# Altium schematic sheet DSO_Control.SchDoc: Schematic_Name
size A4; CompanyName: University of Melbourne; Engineer: Your Name Here; DocumentNumber: 1; Revision: 0.1; SheetNumber: 1; SheetTotal: 1; Title_Project: Project_Title; StudentNo: Student No.
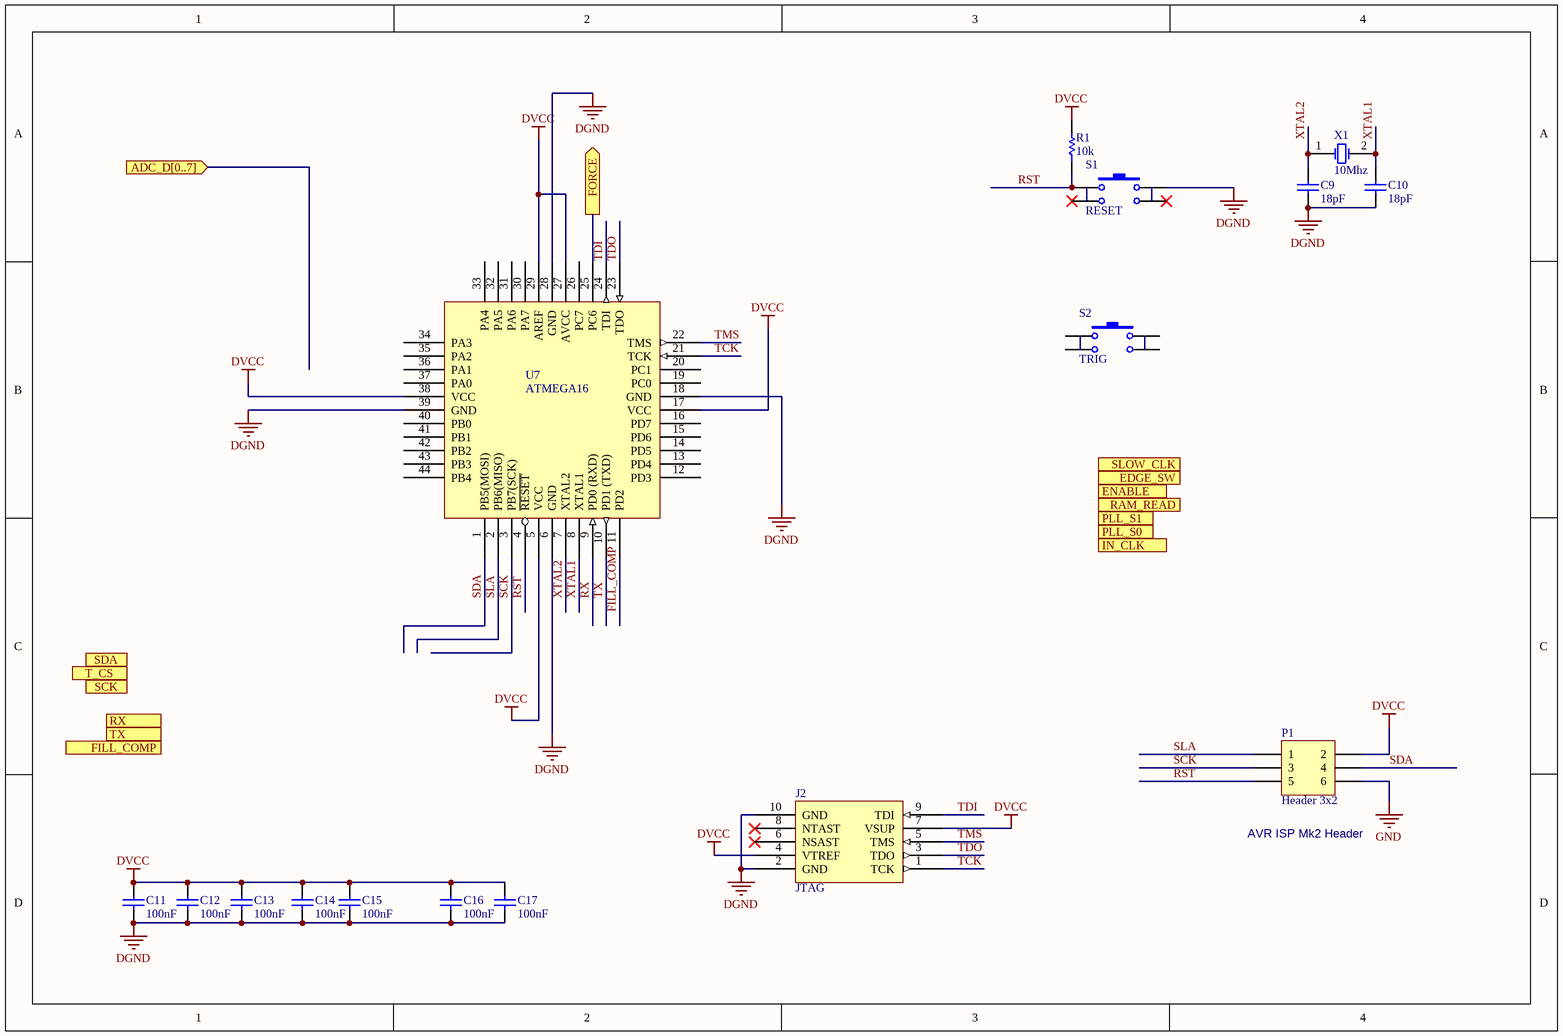
[diagram p0: DSO_Control.SchDoc]

## Parts
C9  18pF  [0805C]
C10  18pF  [0805C]
C11  100nF  [0805C]
C12  100nF  [0805C]
C13  100nF  [0805C]
C14  100nF  [0805C]
C15  100nF  [0805C]
C16  100nF  [0805C]
C17  100nF  [0805C]
J2  JTAG  [BOXEDVERT10]
P1  Header 3x2  [HDR3x2]
R1  10k  [0805]
S1  RESET  [SPST PB SWITCH SMD]
S2  TRIG  [SPST PB SWITCH SMD]
U7  ATMEGA16  [QFP-48]
X1  10Mhz  [XTAL_FLAT_SMD]

## Ports
ADC_D[0..7] (in), EDGE_SW (out), ENABLE (out), FILL_COMP (in), FORCE (out), IN_CLK (out), PLL_S0 (out), PLL_S1 (out), RAM_READ (out), RX (in), SCK (out), SDA (out), SLOW_CLK (out), T_CS (out), TX (out)

## Nets
DGND: C9.2 C10.2 C11.2 C12.2 C13.2 C14.2 C15.2 C16.2 C17.2 J2.2(GND) J2.10(GND) S1.2 U7.6(GND) U7.18(GND) U7.28(GND) U7.39(GND)
DVCC: C11.1 C12.1 C13.1 C14.1 C15.1 C16.1 C17.1 J2.4(VTREF) J2.7(VSUP) P1.2 R1.2 U7.5(VCC) U7.17(VCC) U7.27(AVCC) U7.29(AREF) U7.38(VCC)
GND: P1.6
FILL_COMP: U7.11(PD2)
FORCE: U7.25(PC6) ; port FORCE
RST: P1.5 R1.1 S1.1 U7.4(~{RESET})
RX: U7.9(PD0_(RXD))
SCK: P1.3 U7.3(PB7(SCK))
SDA: P1.4 U7.1(PB5(MOSI))
SLA: P1.1 U7.2(PB6(MISO))
TCK: J2.1(TCK) U7.21(TCK)
TDI: J2.9(TDI) U7.24(TDI)
TDO: J2.3(TDO) U7.23(TDO)
TMS: J2.5(TMS) U7.22(TMS)
TX: U7.10(PD1_(TXD))
XTAL1: C10.1 U7.8(XTAL1) X1.2(OSC2)
XTAL2: C9.1 U7.7(XTAL2) X1.1(OSC1)

Not connected (* = marked no-connect by the designer): J2 6(NSAST)* 8(NTAST)*; S1 3* 4*; S2 1 2 3 4; U7 12(PD3) 13(PD4) 14(PD5) 15(PD6) 16(PD7) 19(PC0) 20(PC1) 26(PC7) 30(PA7) 31(PA6) 32(PA5) 33(PA4) 34(PA3) 35(PA2) 36(PA1) 37(PA0) 40(PB0) 41(PB1) 42(PB2) 43(PB3) 44(PB4)

## Notes on the sheet
- (near P1) AVR ISP Mk2 Header

## Library data of the parts
C9-C17 = C: Capacitor; Reviewed by: RM - 2018/08/05; Revision: July-2002: Re-released for DXP Platform.; Supplier 1: *; Supplier Part Number 1: *
  C9 C10: Value: 18pF
  C11-C17: Value: 100nF
J2 = JTAG_CON: Reviewed by: RM - 2018/08/05; Supplier 1: Digi-Key; Supplier Part Number 1: OR896-ND
P1 = Header 3x2: Header, 5-Pin; Reviewed by: RM - 2018/08/05; Supplier 1: Digi-Key; Supplier Part Number 1: 952-2121-ND
R1 = R: Resistor; Reviewed by: RM - 2018/08/05; Value: 10k; Supplier 1: *; Suppler Part Number 1: *
S1 S2 = SW_PB_1P1T4: Momentary Push Button Switch 1P 1T 2pins; Reviewed by: RM - 2018/08/05; Revision: July-2002: Re-released for DXP Platform.; Supplier 1: Digi-Key; Supplier Part Number 1: CKN9085CT-ND
U7 = ATMEGA16: ATMEGA16 Microcontroller; Reviewed by: RM - 2018/08/05; Supplier 1: Digi-Key; Supplier Part Number 1: ATMEGA16A-AU-ND
X1 = XTAL: Crystal Oscillator; Reviewed by: RM - 2018/08/05; Revision: July-2002: Re-released for DXP Platform.; Supplier 1: Digi-Key; Supplier Part Number 1: 887-1080-1-ND